# EAGLE design tiny (EAGLE 9.5.2)
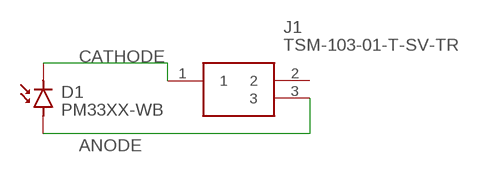
[diagram p0: schematic, sheet 1]

## Parts
D1  PM33XX-WB  [PM33XX-WB]
J1  TSM-103-01-T-SV-TR  [HUSRSP3W64P254_762X254X858P]

## Nets
ANODE: D1.1(ANODE) D1.2(ANODE) J1.3
CATHODE: D1.3(CATHODE) D1.4(CATHODE) J1.1
Unconnected: J1.2

## Library data of the parts
D1 = KETEK SiliconPM:PM33XX: Silicon Photomultiplier with 3x3 mm² active area Download datasheet <https://www.ketek.net/documentation/sipm-downloads/>
J1 = TSM-103-01-T-SV-TR:TSM-103-01-T-SV-TR: Headers & Wire Housings .100" Surface Mount Terminal Strip Source: Datasheet <http://suddendocs.samtec.com/catalog_english/tsm.pdf>; ARROW_PART_NUMBER: TSM-103-01-T-SV-TR; ARROW_PRICE-STOCK: https://www.arrow.com/en/products/tsm-103-01-t-sv-tr/samtec; DESCRIPTION: Headers & Wire Housings .100" Surface Mount Terminal Strip; HEIGHT: mm; MANUFACTURER_NAME: SAMTEC; MANUFACTURER_PART_NUMBER: TSM-103-01-T-SV-TR; MOUSER_PART_NUMBER: 200-TSM10301TSVTR; MOUSER_PRICE-STOCK: https://www.mouser.co.uk/ProductDetail/Samtec/TSM-103-01-T-SV-TR/?qs=0lQeLiL1qybtyMm2dzXtjQ%3D%3D

## Board
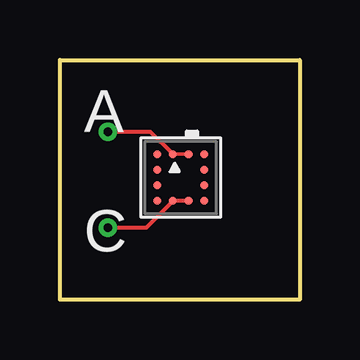
[diagram p1: board, top side]
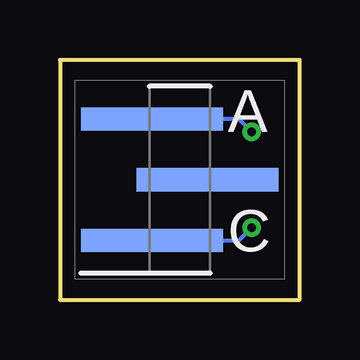
[diagram p2: board, bottom side, seen from below]

Size 10 x 10 mm. Coordinates in mm from the lower left corner, seen from the top.
Outline: 0,0 0,10 10,10 10,0 0,0
Copper layers (1*16): Top 0.035mm / dielectric 1.5mm / Bottom 0.035mm
Design rules "default": minimum track width 6mil, minimum drill 0.35mm, track to track 6mil, track to pad 6mil, pad to pad 6mil, via to via 6mil, smd to smd 6mil, copper to edge 40mil, drill to drill 6mil, minimum pad ring 10mil, minimum via ring 8mil, stop-mask expansion 4mil, vias tented up to drill 0mil, thermal gap 10mil

### Footprints (pad centres in the part's own frame; a part is rotated, then mirrored left to right if it is on the bottom)
PM33XX-WB = smd 0.33 x 0.33: 1 -0.325,0.975; 2 0.325,0.975; 3 -0.325,-0.975; 4 0.325,-0.975; N1 0.975,0.975; N2 0.975,0.325; N3 0.975,-0.325; N4 0.975,-0.975; N5 -0.975,0.975; N6 -0.975,0.325; N7 -0.975,-0.325; N8 -0.975,-0.975
HUSRSP3W64P254_762X254X858P = smd 0.96 x 5.92: 1 -2.54,1.16; 2 0,-1.16; 3 2.54,1.16

### Placement (x,y rotation side)
D1  5.04,5.09 0 top
J1  5,5 90 bottom

### Tracks (layer width: path | path; a pad name or v marks a point on that pad's centre or on a via)
ANODE  (via drill 0.35)
  Top 0.152: D1.1 D1.2
  Top 0.16: D1.1 3.78,7 v2,7
  Bottom 0.16: v2,7 2.54,7.54 J1.3
CATHODE  (via drill 0.35)
  Top 0.16: D1.4 D1.3 3.6,3 v2,3
  Bottom 0.16: J1.1 2.54,2.46 v2,3

### Text on the board
tPlace: A | C
bPlace: A | C